# EAGLE schematic SBC_Gameduino (EAGLE 9.6.2)
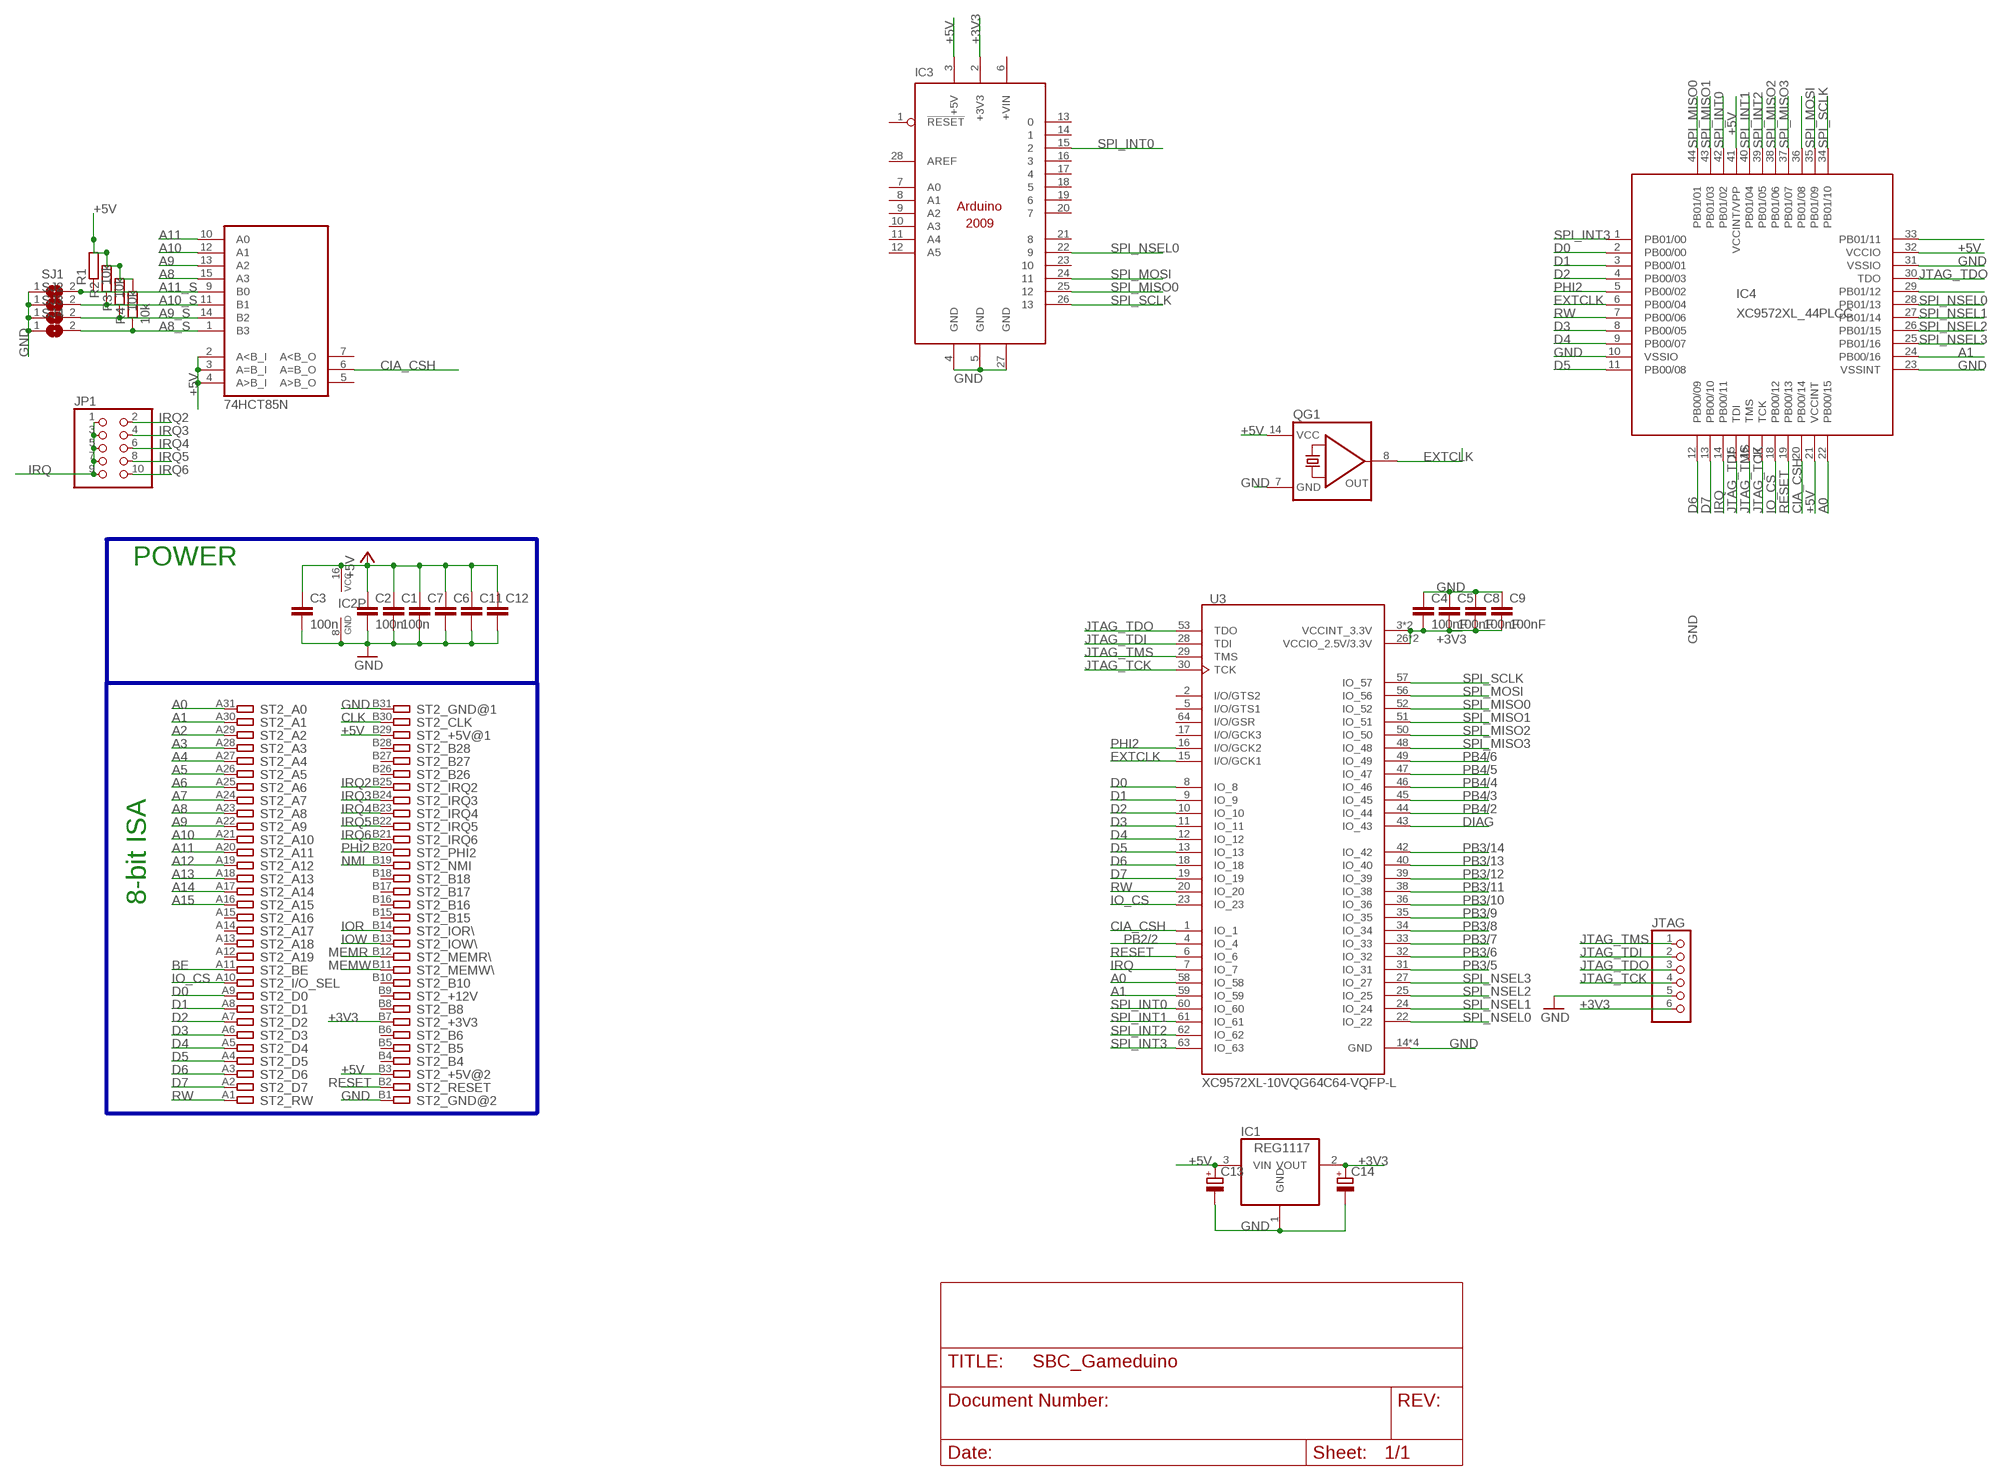
[diagram p0: schematic, sheet 1]

## Parts
C1  100n  C-EU050-025X075  [C050-025X075]
C2  100n  C-EU050-025X075  [C050-025X075]
C3  100n  C-EU050-025X075  [C050-025X075]
C4  100nF  CAPC603  [C603]
C5  100nF  CAPC603  [C603]
C6  C-EU050-035X075  [C050-035X075]
C7  C-EU050-035X075  [C050-035X075]
C8  100nF  CAPC603  [C603]
C9  100nF  CAPC603  [C603]
C11  C-EU050-035X075  [C050-035X075]
C12  C-EU050-035X075  [C050-035X075]
C13  CPOL-EUE2.5-5  [E2,5-5]
C14  CPOL-EUE2.5-5  [E2,5-5]
IC1  REG1117  [SOT223]
IC2  74HCT85N  [DIL16]
IC3  ARDUINO2009_10  [ARDUINO2009]
IC4  XC9572XL_44PLCC  XC9536_44PLCCPLCC44_THT  [S44]
JP1  PINHD-2X5  [2X05]
JTAG  PINHD-1X6  [1X06]
QG1  QG5860  [DIL14S]
R1  10k  R-EU_0207/7  [0207/7]
R2  10k  R-EU_0207/7  [0207/7]
R3  10k  R-EU_0207/7  [0207/7]
R4  10k  R-EU_0207/7  [0207/7]
SJ1  SJ  [SJ]
SJ2  SJ  [SJ]
SJ3  SJ  [SJ]
SJ4  SJ  [SJ]
ST2  IBM8BIT_ISASHORT  [APP_2X32_SHORT]
U3  XC9572XL-10VQG64C64-VQFP-L  [VQFP64]

## Nets
+3V3: C4.2 C5.2 C8.2 C9.2 C14.+ IC1.2(VOUT) IC3.2(+3V3) JTAG.6 ST2.B7 U3.3(VCCINT_3.3V) U3.26(VCCIO_2.5V/3.3V) U3.37(VCCINT_3.3V) U3.55(VCCIO_2.5V/3.3V)
+5V [power]: C1.1 C2.1 C3.1 C6.1 C7.1 C11.1 C12.1 C13.+ IC1.3(VIN) IC2.2(A<B_I) IC2.3(A=B_I) IC2.4(A>B_I) IC2.16(VCC) IC3.3(+5V) IC4.21(VCCINT) IC4.32(VCCIO) IC4.41(VCCINT/VPP) QG1.14(VCC) R1.2 R2.2 R3.2 R4.2 ST2.B3 ST2.B29
A0: IC4.22(PB00/15) ST2.A31 U3.58(IO_58)
A1: IC4.24(PB00/16) ST2.A30 U3.59(IO_59)
A2: ST2.A29
A3: ST2.A28
A4: ST2.A27
A5: ST2.A26
A6: ST2.A25
A7: ST2.A24
A8: IC2.15(A3) ST2.A23
A8_S: IC2.1(B3) R4.1 SJ4.2
A9: IC2.13(A2) ST2.A22
A9_S: IC2.14(B2) R3.1 SJ3.2
A10: IC2.12(A1) ST2.A21
A10_S: IC2.11(B1) R2.1 SJ2.2
A11: IC2.10(A0) ST2.A20
A11_S: IC2.9(B0) R1.1 SJ1.2
A12: ST2.A19
A13: ST2.A18
A14: ST2.A17
A15: ST2.A16
BE: ST2.A11
CIA_CSH: IC2.6(A=B_O) IC4.20(PB00/14) U3.1(IO_1)
CLK: ST2.B30
D0: IC4.2(PB00/00) ST2.A9 U3.8(IO_8)
D1: IC4.3(PB00/01) ST2.A8 U3.9(IO_9)
D2: IC4.4(PB00/03) ST2.A7 U3.10(IO_10)
D3: IC4.8(PB00/05) ST2.A6 U3.11(IO_11)
D4: IC4.9(PB00/07) ST2.A5 U3.12(IO_12)
D5: IC4.11(PB00/08) ST2.A4 U3.13(IO_13)
D6: IC4.12(PB00/09) ST2.A3 U3.18(IO_18)
D7: IC4.13(PB00/10) ST2.A2 U3.19(IO_19)
DIAG: U3.43(IO_43)
EXTCLK: IC4.6(PB00/04) QG1.8(OUT) U3.15(I/O/GCK1)
GND [power]: C1.2 C2.2 C3.2 C4.1 C5.1 C6.2 C7.2 C8.1 C9.1 C11.2 C12.2 C13.- C14.- IC1.1(GND) IC2.8(GND) IC3.4(GND) IC3.5(GND) IC3.27(GND) IC4.10(VSSIO) IC4.23(VSSINT) IC4.31(VSSIO) JTAG.5 QG1.7(GND) SJ1.1 SJ2.1 SJ3.1 SJ4.1 ST2.B1 ST2.B31 U3.14(GND) U3.21(GND) U3.41(GND) U3.54(GND)
IO_CS: IC4.18(PB00/12) ST2.A10 U3.23(IO_23)
IOR: ST2.B14
IOW: ST2.B13
IRQ: IC4.14(PB00/11) JP1.1 JP1.3 JP1.5 JP1.7 JP1.9 U3.7(IO_7)
IRQ2: JP1.2 ST2.B25
IRQ3: JP1.4 ST2.B24
IRQ4: JP1.6 ST2.B23
IRQ5: JP1.8 ST2.B22
IRQ6: JP1.10 ST2.B21
JTAG_TCK: IC4.17(TCK) JTAG.4 U3.30(TCK)
JTAG_TDI: IC4.15(TDI) JTAG.2 U3.28(TDI)
JTAG_TDO: IC4.30(TDO) JTAG.3 U3.53(TDO)
JTAG_TMS: IC4.16(TMS) JTAG.1 U3.29(TMS)
MEMR: ST2.B12
MEMW: ST2.B11
N$29: IC4.29(PB01/12)
N$33: IC4.33(PB01/11)
N$36: IC4.36(PB01/08)
NMI: ST2.B19
PB2/2: U3.4(IO_4)
PB3/5: U3.31(IO_31)
PB3/6: U3.32(IO_32)
PB3/7: U3.33(IO_33)
PB3/8: U3.34(IO_34)
PB3/9: U3.35(IO_35)
PB3/10: U3.36(IO_36)
PB3/11: U3.38(IO_38)
PB3/12: U3.39(IO_39)
PB3/13: U3.40(IO_40)
PB3/14: U3.42(IO_42)
PB4/2: U3.44(IO_44)
PB4/3: U3.45(IO_45)
PB4/4: U3.46(IO_46)
PB4/5: U3.47(IO_47)
PB4/6: U3.49(IO_49)
PHI2: IC4.5(PB00/02) ST2.B20 U3.16(I/O/GCK2)
RESET: IC4.19(PB00/13) ST2.B2 U3.6(IO_6)
RW: IC4.7(PB00/06) ST2.A1 U3.20(IO_20)
SPI_INT0: IC3.15 IC4.42(PB01/02) U3.60(IO_60)
SPI_INT1: IC4.40(PB01/04) U3.61(IO_61)
SPI_INT2: IC4.39(PB01/05) U3.62(IO_62)
SPI_INT3: IC4.1(PB01/00) U3.63(IO_63)
SPI_MISO0: IC3.25 IC4.44(PB01/01) U3.52(IO_52)
SPI_MISO1: IC4.43(PB01/03) U3.51(IO_51)
SPI_MISO2: IC4.38(PB01/06) U3.50(IO_50)
SPI_MISO3: IC4.37(PB01/07) U3.48(IO_48)
SPI_MOSI: IC3.24 IC4.35(PB01/09) U3.56(IO_56)
SPI_NSEL0: IC3.22 IC4.28(PB01/13) U3.22(IO_22)
SPI_NSEL1: IC4.27(PB01/14) U3.24(IO_24)
SPI_NSEL2: IC4.26(PB01/15) U3.25(IO_25)
SPI_NSEL3: IC4.25(PB01/16) U3.27(IO_27)
SPI_SCLK: IC3.26 IC4.34(PB01/10) U3.57(IO_57)
Unconnected: IC2.5(A>B_O) IC2.7(A<B_O) IC3.1(!RESET) IC3.6(+VIN) IC3.7(A0) IC3.8(A1) IC3.9(A2) IC3.10(A3) IC3.11(A4) IC3.12(A5) IC3.13 IC3.14 IC3.16 IC3.17 IC3.18 IC3.19 IC3.20 IC3.21 IC3.23 IC3.28(AREF) ST2.A12 ST2.A13 ST2.A14 ST2.A15 ST2.B4 ST2.B5 ST2.B6 ST2.B8 ST2.B9 ST2.B10 ST2.B15 ST2.B16 ST2.B17 ST2.B18 ST2.B26 ST2.B27 ST2.B28 U3.2(I/O/GTS2) U3.5(I/O/GTS1) U3.17(I/O/GCK3) U3.64(I/O/GSR)

## Buses
A8,A9,A10,A11,ACIA_CS,IO_CS,IO_CS_N,N$3,N$4,N$8

## Notes on the sheet
- POWER
- 8-bit ISA

## Library data of the parts
C1-C3 = rcl:C-EU: CAPACITOR, European symbol
C4 C5 C8 C9 = dp_devices:CAP
C6 C7 C11 C12 = rcl:C-EU: CAPACITOR, European symbol; SPICEPREFIX: C
C13 C14 = rcl:CPOL-EU: POLARIZED CAPACITOR, European symbol; SPICEPREFIX: C
IC1 = burr-brown:REG1117: 800mA and 1A Low Dropout (LDO) Positive Regulator 1.8V, 2.5V, 2.85V, 3.3V, 5V, and Adj; MPN: REG1117; OC_FARNELL: 1097566; OC_NEWARK: 14P6981
IC2 = 74xx-eu:74*85: 4-bit magnitude COMPARATOR
IC3 = arduino:ARDUINO2009_1: The Arduino Duemilanove ("2009") is a microcontroller board based on the ATmega168 or ATmega328. - 14 digital input/output pins (of which 6 can be used as PWM outputs) - 6 analog inputs, a 16 MHz crystal oscillator - USB connection - power jack - ISP header - reset button It contains everything needed to support the microcontroller; simply connect it to a computer with a USB cable or power it with a AC-to-DC adapter or battery to get started http://arduino.cc/en/Main/ArduinoBoardDuemilanove
IC4 = Xilinx_tirorin:XC9536_44PLCC: xc9536_pc44 XC9500 In-System Programmable CPLD Family Auto generated by make-symbol-device-package-bsdl.ulp Rev. 34 Source: xc9536_pc44.bsd
JP1 = pinhead:PINHD-2X5: PIN HEADER
JTAG = pinhead:PINHD-1X6: PIN HEADER
QG1 = crystal:QG5860: CRYSTAL RESONATOR; OC_FARNELL: unknown; OC_NEWARK: unknown
R1-R4 = rcl:R-EU_: RESISTOR, European symbol; SPICEPREFIX: R
SJ1-SJ4 = jumper:SJ: SMD solder JUMPER
ST2 = TiRoRiN_Libs:IBM8BIT_ISA: 8-bit CARD IBM/PC-AT
U3 = CPLD:XC9572XL-10VQG64C: IC CPLD 72MC 10NS 64VQFP Manufacturer's datasheet <https://www.xilinx.com/support/documentation/data_sheets/ds057.pdf>; CREATED_BY: PCBLayout.com; DIGIKEY_PARTNO: 122-1388-ND; MANUFACTURER: Xilinx Inc; MPN: XC9572XL-10VQG64C; PACKAGE: VQFP-64

## Net classes
0 default: width 0.152 mm, drill 0.2 mm, clearance 0.152 mm
1 power: width 0.254 mm, drill 0.66 mm, clearance 0.152 mm to class 0, clearance 0.152 mm
2 data: width 0.254 mm, drill 0.66 mm, clearance 0.152 mm to class 0, clearance 0.152 mm to class 1, clearance 0.152 mm